# Altium project sumpower.PrjPcb
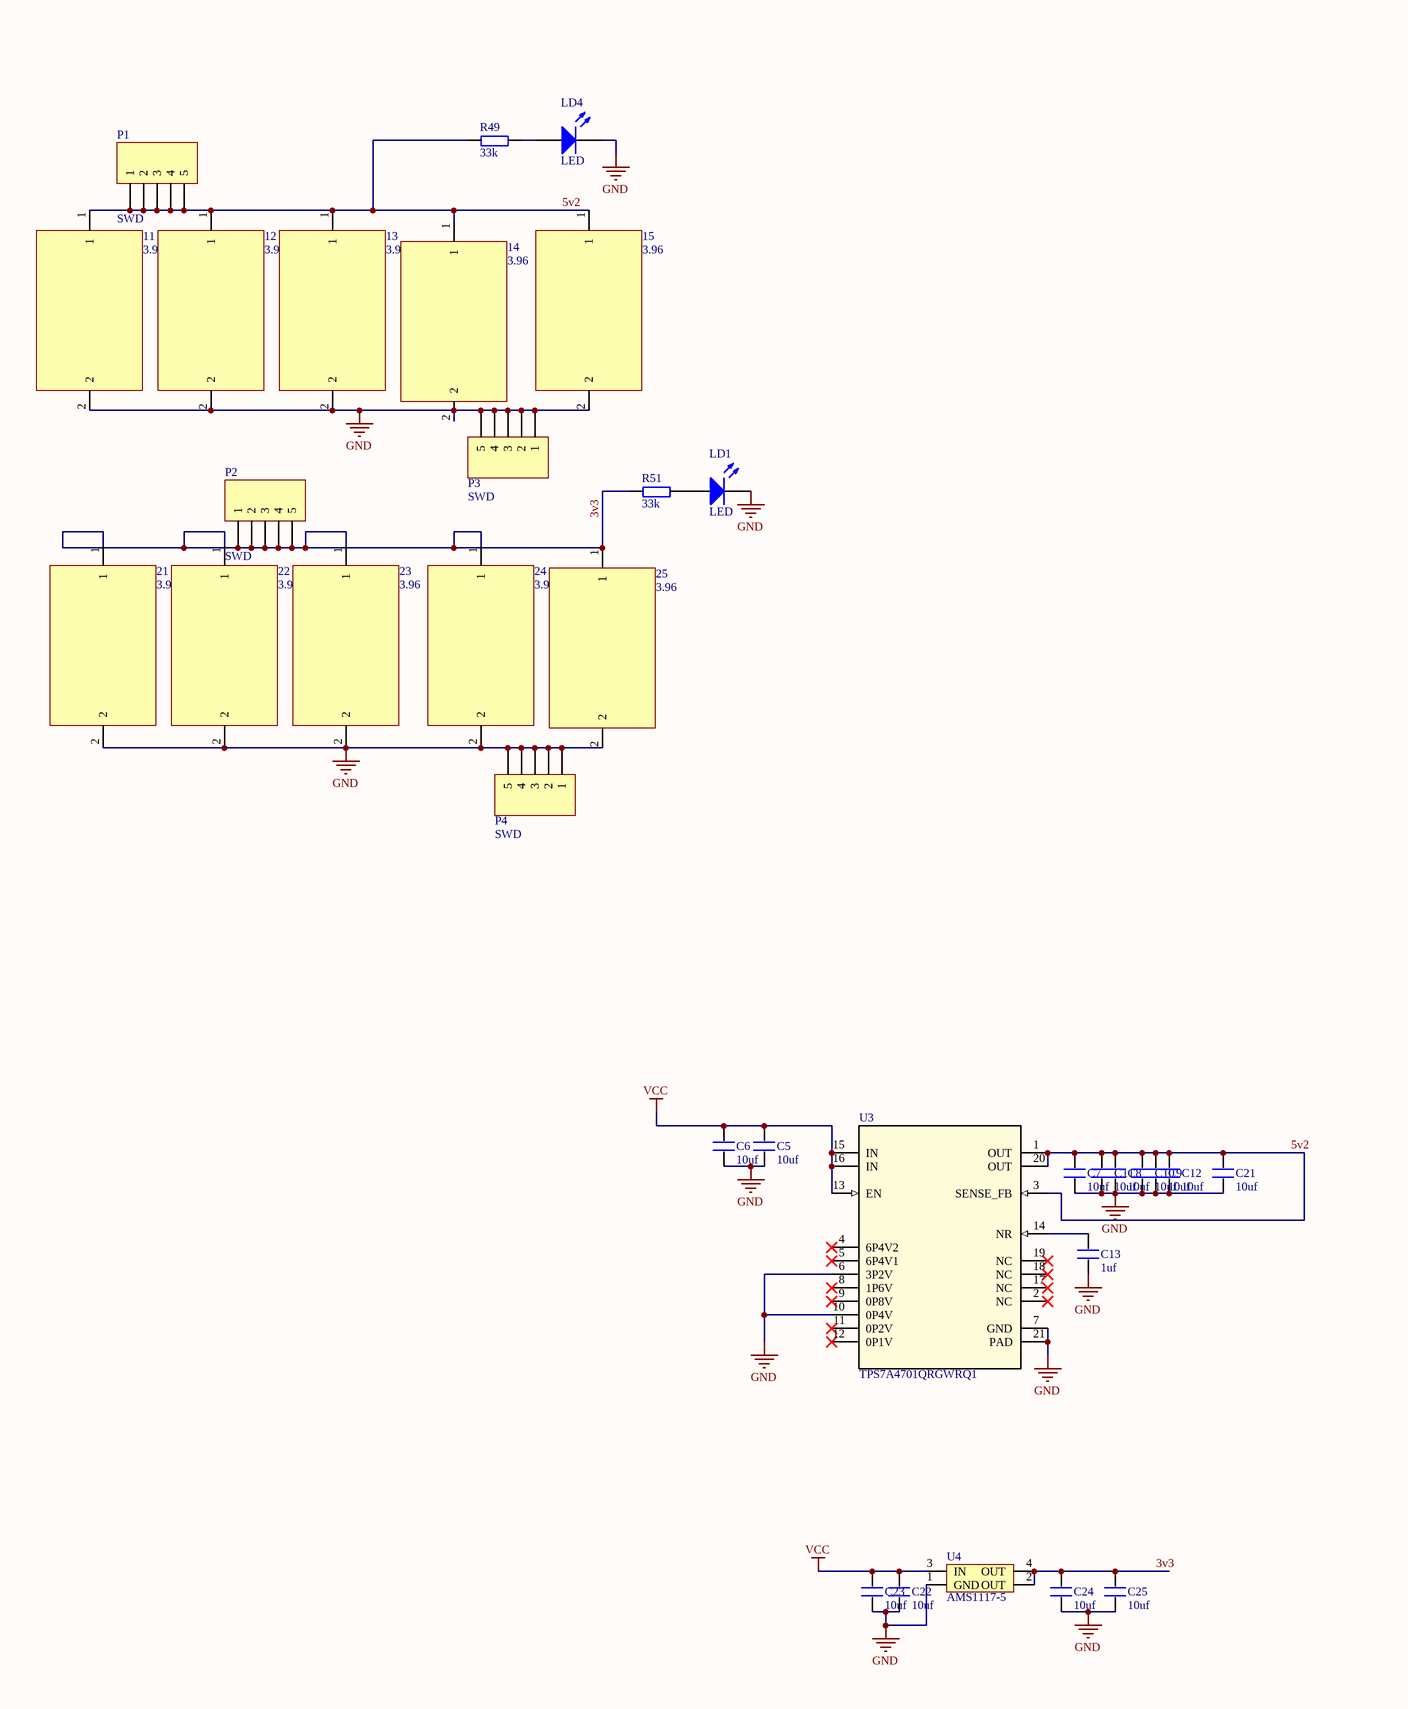
[diagram p0: sumpower.SchDoc, left]
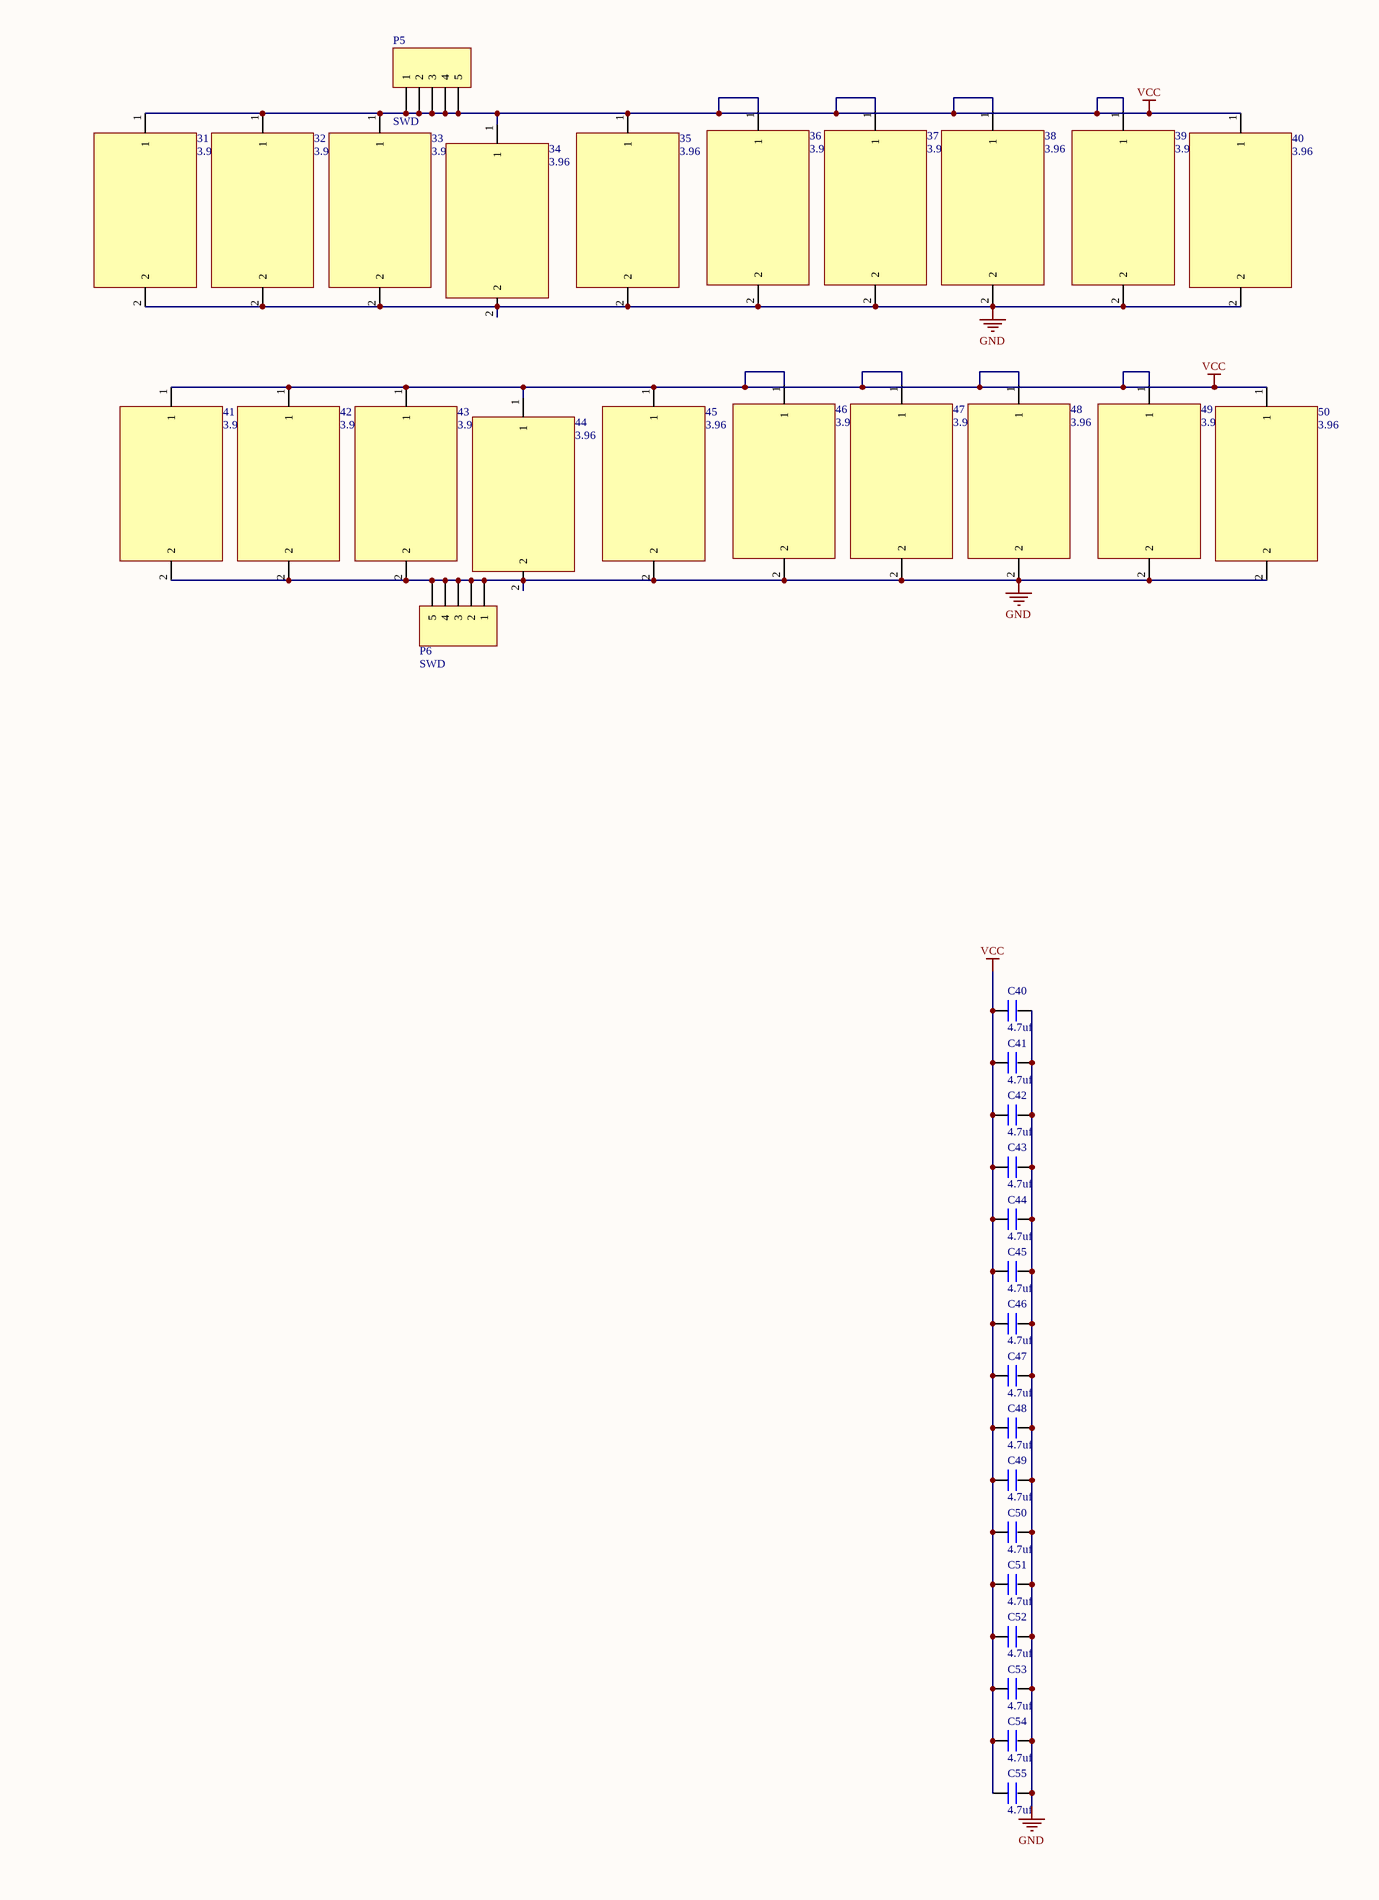
[diagram p1: sumpower.SchDoc, right]
1 sheet, 72 parts. Net scope: global (net labels, ports and power ports of the same name join across sheets).
Board file: sumpower.PcbDoc

## Sheet sumpower.SchDoc
size A2

### Parts
11  3.96  [3.96]
12  3.96  [3.96]
13  3.96  [3.96]
14  3.96  [3.96]
15  3.96  [3.96]
21  3.96  [3.96]
22  3.96  [3.96]
23  3.96  [3.96]
24  3.96  [3.96]
25  3.96  [3.96]
31  3.96  [3.96]
32  3.96  [3.96]
33  3.96  [3.96]
34  3.96  [3.96]
35  3.96  [3.96]
36  3.96  [3.96]
37  3.96  [3.96]
38  3.96  [3.96]
39  3.96  [3.96]
40  3.96  [3.96]
41  3.96  [3.96]
42  3.96  [3.96]
43  3.96  [3.96]
44  3.96  [3.96]
45  3.96  [3.96]
46  3.96  [3.96]
47  3.96  [3.96]
48  3.96  [3.96]
49  3.96  [3.96]
50  3.96  [3.96]
C5  10uf  [0603C]
C6  10uf  [0603C]
C7  10uf  [0603C]
C8  10uf  [0603C]
C9  10uf  [0603C]
C10  10uf  [0603C]
C11  10uf  [0603C]
C12  10uf  [0603C]
C13  1uf  [0402]
C21  10uf  [0603C]
C22  10uf  [0603C]
C23  10uf  [0603C]
C24  10uf  [0603C]
C25  10uf  [0603C]
C40  4.7uf  [0603C]
C41  4.7uf  [0603C]
C42  4.7uf  [0603C]
C43  4.7uf  [0603C]
C44  4.7uf  [0603C]
C45  4.7uf  [0603C]
C46  4.7uf  [0603C]
C47  4.7uf  [0603C]
C48  4.7uf  [0603C]
C49  4.7uf  [0603C]
C50  4.7uf  [0603C]
C51  4.7uf  [0603C]
C52  4.7uf  [0603C]
C53  4.7uf  [0603C]
C54  4.7uf  [0603C]
C55  4.7uf  [0603C]
LD1  LED  [SMDLED]
LD4  LED  [SMDLED]
P1  SWD  [HDR1X5]
P2  SWD  [HDR1X5]
P3  SWD  [HDR1X5]
P4  SWD  [HDR1X5]
P5  SWD  [HDR1X5]
P6  SWD  [HDR1X5]
R49  33k  [0603R]
R51  33k  [0603R]
U3  TPS7A4701QRGWRQ1  [RGW0020A]
U4  AMS1117-5  [AMS1117]

### Nets
GND: 11.2 12.2 13.2 14.2 15.2 21.2 22.2 23.2 24.2 25.2 31.2 32.2 33.2 34.2 35.2 36.2 37.2 38.2 39.2 40.2 41.2 42.2 43.2 44.2 45.2 46.2 47.2 48.2 49.2 50.2 C5.1 C6.1 C7.1 C8.1 C9.1 C10.1 C11.1 C12.1 C13.1 C21.1 C22.1 C23.1 C24.1 C25.1 C40.2 C41.2 C42.2 C43.2 C44.2 C45.2 C46.2 C47.2 C48.2 C49.2 C50.2 C51.2 C52.2 C53.2 C54.2 C55.2 LD1.2(K) LD4.2(K) P3.1 P3.2 P3.3 P3.4 P3.5 P4.1 P4.2 P4.3 P4.4 P4.5 P6.1 P6.2 P6.3 P6.4 P6.5 U3.6(3P2V) U3.7(GND) U3.10(0P4V) U3.21(PAD) U4.1(GND)
VCC: 31.1 32.1 33.1 34.1 35.1 36.1 37.1 38.1 39.1 40.1 41.1 42.1 43.1 44.1 45.1 46.1 47.1 48.1 49.1 50.1 C5.2 C6.2 C22.2 C23.2 C40.1 C41.1 C42.1 C43.1 C44.1 C45.1 C46.1 C47.1 C48.1 C49.1 C50.1 C51.1 C52.1 C53.1 C54.1 C55.1 P5.1 P5.2 P5.3 P5.4 P5.5 U3.13(EN) U3.15(IN) U3.16(IN) U4.3(IN)
3v3: 21.1 22.1 23.1 24.1 25.1 C24.2 C25.2 P2.1 P2.2 P2.3 P2.4 P2.5 R51.1 U4.2(OUT) U4.4(OUT)
5v2: 11.1 12.1 13.1 14.1 15.1 C7.2 C8.2 C9.2 C10.2 C11.2 C12.2 C21.2 P1.1 P1.2 P1.3 P1.4 P1.5 R49.1 U3.1(OUT) U3.3(SENSE_FB) U3.20(OUT)
NetC13_2: C13.2 U3.14(NR)
NetLD1_1: LD1.1(A) R51.2
NetLD4_1: LD4.1(A) R49.2

Not connected (* = marked no-connect by the designer): U3 2(NC)* 4(6P4V2)* 5(6P4V1)* 8(1P6V)* 9(0P8V)* 11(0P2V)* 12(0P1V)* 17(NC)* 18(NC)* 19(NC)*

### Library data of the parts
C5-C13 C21-C25 C40-C55 = C: Capacitor
LD1 LD4 = LED: Typical RED, GREEN, YELLOW, AMBER GaAs LED; Published: 8-Jun-2000; LatestRevisionDate: 17-Jul-2002; LatestRevisionNote: Re-released for DXP Platform.; PackageDocument: Feb-2002; PackageReference: 3.2X1.6X1.1; Publisher: Altium Limited
P1-P6 = Header 5: Header, 5-Pin; LatestRevisionDate: 17-Jul-2002; LatestRevisionNote: Re-released for DXP Platform.; Publisher: Altium Limited
R49 R51 = Resistor
U3 = TPS7A4701QRGWRQ1: No Description Available; Manufacturer: Texas Instruments; PartNumber: TPS7A4701QRGWRQ1; RefDes: RefDes; Type: DEV; Value: Value; Copyright: Copyright (C) 2018 Accelerated Designs. All rights reserved
U4 = AMS1117